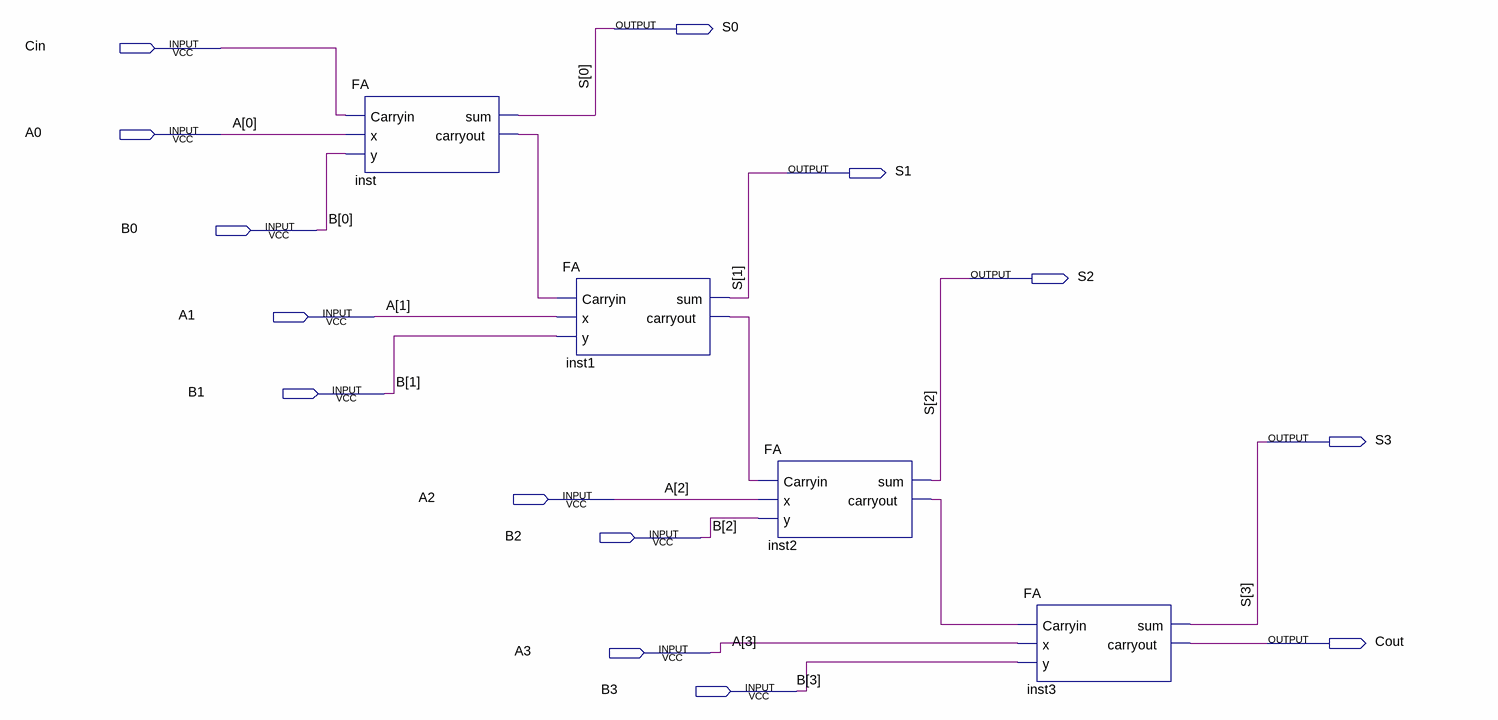
[diagram p0: schematic sheet]
// Quartus schematic Ripple_Carry_Adder.bdf as structural Verilog: 4 symbols, 14 pins
module Ripple_Carry_Adder (
  input  Cin,
  input  A0,
  input  B0,
  input  A1,
  input  B1,
  input  A2,
  input  B2,
  input  A3,
  input  B3,
  output S0,
  output S1,
  output S2,
  output S3,
  output Cout
);

  wire inst1_carryout, inst2_carryout, inst_carryout;

  FA inst (.Carryin(Cin), .x(A0), .y(B0), .sum(S0), .carryout(inst_carryout));
  FA inst1 (.Carryin(inst_carryout), .x(A1), .y(B1), .sum(S1), .carryout(inst1_carryout));
  FA inst2 (.Carryin(inst1_carryout), .x(A2), .y(B2), .sum(S2), .carryout(inst2_carryout));
  FA inst3 (.Carryin(inst2_carryout), .x(A3), .y(B3), .sum(S3), .carryout(Cout));
endmodule
